# Altium schematic sheet POWER.SchDoc
size A3
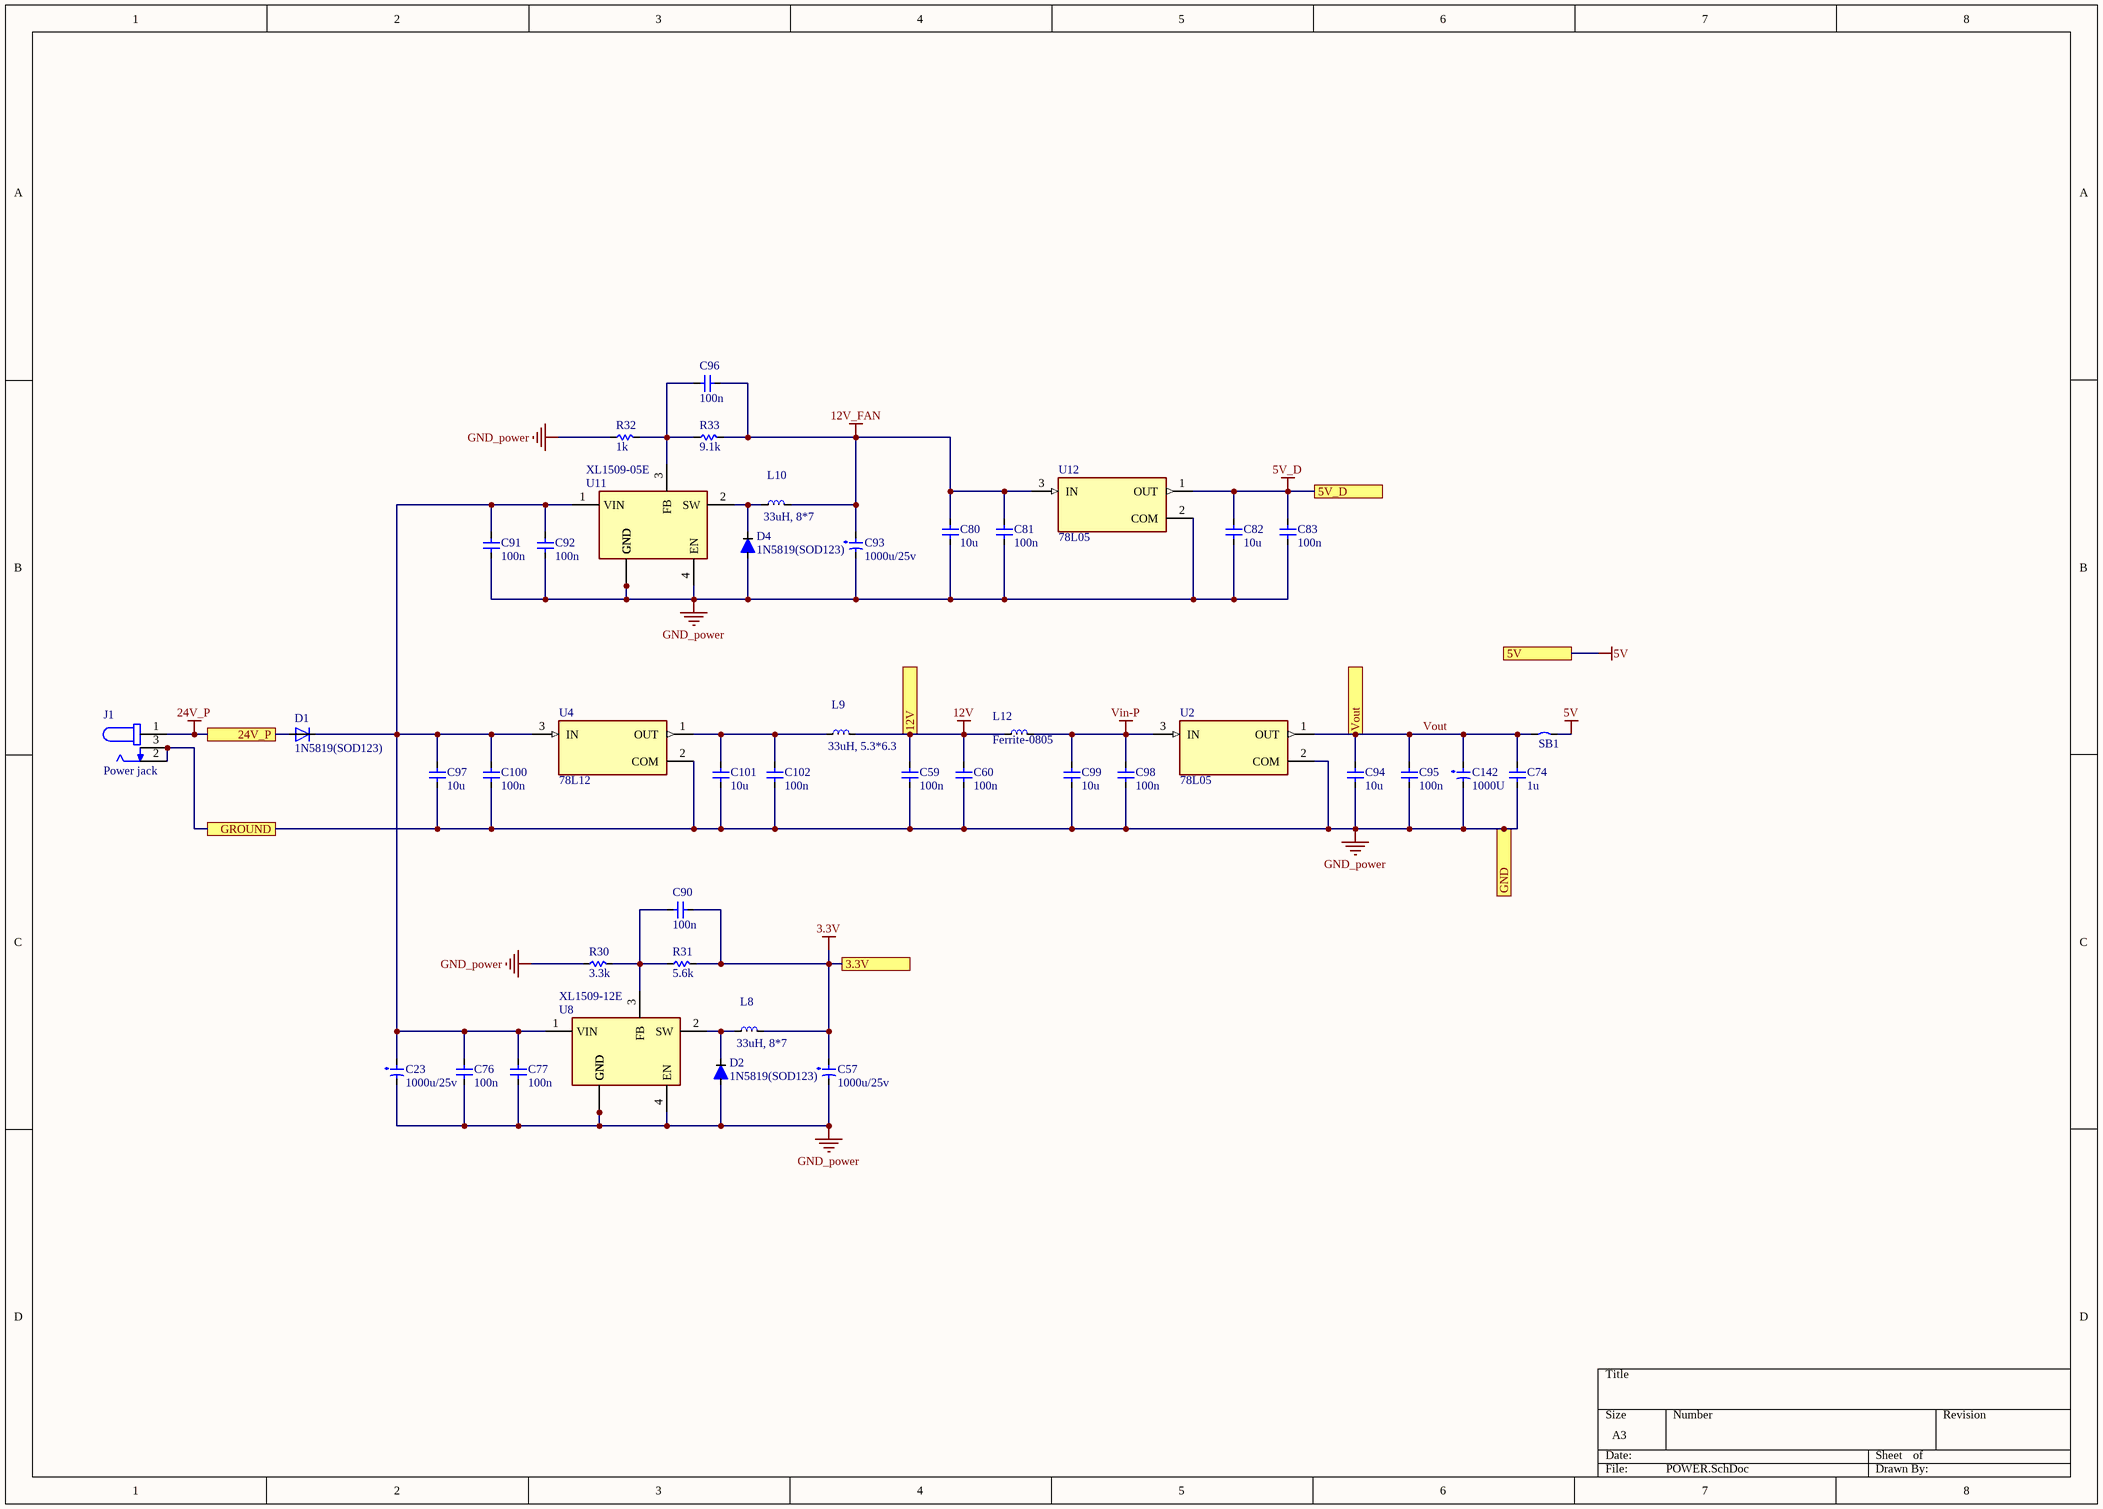
[diagram p0: POWER.SchDoc]

## Parts
C23  1000u/25v  [CAP DIP 10*13]
C57  1000u/25v  [CAP DIP 10*13]
C59  100n  [cap0603]
C60  100n  [cap0603]
C74  1u  [cap0603]
C76  100n  [cap0603]
C77  100n  [cap0603]
C80  10u  [CAP 0805]
C81  100n  [cap0603]
C82  10u  [CAP 0805]
C83  100n  [cap0603]
C90  100n  [cap0603]
C91  100n  [cap0603]
C92  100n  [cap0603]
C93  1000u/25v  [CAP DIP 10*13]
C94  10u  [CAP 0805]
C95  100n  [cap0603]
C96  100n  [cap0603]
C97  10u  [CAP 0805]
C98  100n  [cap0603]
C99  10u  [CAP 0805]
C100  100n  [cap0603]
C101  10u  [CAP 0805]
C102  100n  [cap0603]
C142  1000U  [cap  dip 10*20]
D1  1N5819(SOD123)  [1N5819 SOD-123]
D2  1N5819(SOD123)  [1N5819 SOD-123]
D4  1N5819(SOD123)  [1N5819 SOD-123]
J1  Power jack  [Power jack]
L8  33uH, 8*7  [Inductor 8*7]
L9  33uH, 5.3*6.3  [Inductor SMD 5.3x6.3mm]
L10  33uH, 8*7  [Inductor 8*7]
L12  Ferrite-0805  [Ferrite-0805]
R30  3.3k  [RES-0603]
R31  5.6k  [RES-0603]
R32  1k  [RES-0603]
R33  9.1k  [RES-0603]
SB1  jumper  [JP2_SMD]  (value not drawn)
U2  78L05  [78L05]
U4  78L12  [78L05]
U8  XL1509-12E  [FR9886]
U11  XL1509-05E  [FR9886]
U12  78L05  [78L05]

## Ports
3.3V, 5V, 5V_D, 12V, 24V_P, GND, GROUND, Vout

## Nets
3.3V: C57.1(POS) C90.1 L8.1 R31.2 ; port 3.3V
5V: SB1.2 ; port 5V
5V_D: C82.2 C83.2 U12.1(OUT) ; port 5V_D
12V: C59.2 C60.2 L9.1 L12.2 ; port 12V
12V_FAN: C80.2 C81.2 C93.1(POS) C96.1 L10.1 R33.2 U12.3(IN)
24V_P: D1.2(A) J1.1 ; port 24V_P
GND_power: C23.2(NEG) C57.2(NEG) C59.1 C60.1 C74.1 C76.1 C77.1 C80.1 C81.1 C82.1 C83.1 C91.1 C92.1 C93.2(NEG) C94.1 C95.1 C97.1 C98.1 C99.1 C100.1 C101.1 C102.1 C142.2(NEG) D2.2(C) D4.2(C) J1.2 J1.3 R30.1 R32.1 U2.2(COM) U4.2(COM) U8.4(EN) U8.5(GND) U8.6(GND) U8.7(GND) U8.8(GND) U11.4(EN) U11.5(GND) U11.6(GND) U11.7(GND) U11.8(GND) U12.2(COM) ; port GND, port GROUND
Vin-P: C98.2 C99.2 L12.1 U2.3(IN)
Vout: C74.2 C94.2 C95.2 C142.1(POS) SB1.1 U2.1(OUT) ; port Vout
NetC23_1: C23.1(POS) C76.2 C77.2 C91.2 C92.2 C97.2 C100.2 D1.1(K) U4.3(IN) U8.1(VIN) U11.1(VIN)
NetC90_2: C90.2 R30.2 R31.1 U8.3(FB)
NetC96_2: C96.2 R32.2 R33.1 U11.3(FB)
NetC101_2: C101.2 C102.2 L9.2 U4.1(OUT)
NetD2_1: D2.1(A) L8.2 U8.2(SW)
NetD4_1: D4.1(A) L10.2 U11.2(SW)

## Library data of the parts
C23 C57 C93 = capacitor dip 10*13: 2200ÂµF 50V Aluminum Electrolytic Capacitors Radial, Can 1000 Hrs @ 105Â°C; MF: Nichicon; MP: UVZ1H222MHD; Package: Radial Nichicon; Value: *; Price: None; SnapEDA_Link: https://www.snapeda.com/parts/UVZ1H222MHD/Nichicon/view-part/468437/?ref=snap; Availability: Unavailable
C59 C60 C74 C76 C77 C81 C83 C90-C92 C95 C96 C98 C100 C102 = Cap 0603: Capacitor 0603; Value: 104; Published: 8-Jun-2000; LatestRevisionDate: 17-Jul-2002; LatestRevisionNote: Re-released for DXP Platform.; Publisher: Altium Limited
C80 C82 C94 C97 C99 C101 = Cap 0805: Capacitor 0805; Value: 104; Published: 8-Jun-2000; LatestRevisionDate: 17-Jul-2002; LatestRevisionNote: Re-released for DXP Platform.; Publisher: Altium Limited
C142 = capacitor dip 10*20: 2200ÂµF 50V Aluminum Electrolytic Capacitors Radial, Can 1000 Hrs @ 105Â°C; MF: Nichicon; MP: UVZ1H222MHD; Package: Radial Nichicon; Value: *; Price: None; SnapEDA_Link: https://www.snapeda.com/parts/UVZ1H222MHD/Nichicon/view-part/468437/?ref=snap; Availability: Unavailable
D1 D2 D4 = 1N5819(SOD123): Shotkey diod SOD-123; MP: BAS716; MF: Nexperia USA; SnapEDA_Link: https://www.snapeda.com/parts/BAS716/Nexperia%20USA%20Inc./view-part/143287/?ref=snap; Price: None; Package: SOD-523 NXP Semiconductors; Arrow_Electronics-Purchase-URL: https://snapeda.com/shop?store=Arrow+Electronics&id=143287; Value: *; Availability: Unavailable
J1 = Power jack: 2.0 x 6.5 mm, 2.5 A, Horizontal, Through Hole, Tapered Pins, Dc Power Jack Connector; MF: CUI Devices; MP: PJ-102A; CUI_purchase_URL: https://www.cuidevices.com/product/interconnect/connectors/dc-power-connectors/jacks/pj-102a?utm_source=snapeda.com&utm_medium=referral&utm_campaign=snapedaBOM; Price: None; SnapEDA_Link: https://www.snapeda.com/parts/PJ-102A/CUI%20Devices/view-part/55545/?ref=snap; Value: *; Availability: Unavailable; Package: None
L8 L10 = INDUCTOR 8*7: Inductor round 8*7; MP: DR127-330-R; MF: Eaton; Price: None; Package: Nonstandard Eaton; Availability: Unavailable; SnapEDA_Link: https://www.snapeda.com/parts/DR127-330-R/Eaton/view-part/?ref=snap; Value: *
L9 = INDUCTOR 5.3*6.3: Inductor round 5.3*6.3; MP: DR127-330-R; MF: Eaton; Price: None; Package: Nonstandard Eaton; Availability: Unavailable; SnapEDA_Link: https://www.snapeda.com/parts/DR127-330-R/Eaton/view-part/?ref=snap; Value: *
L12 = Ferrite _0805: BLM Series 0805 330 Ohm 400 mA 0.58 Ohm DCR Surface Mount Ferrite Bead; MF: Murata; MP: BLM18BB331SN1D; Package: 0603 Murata; Price: None; Availability: Unavailable; SnapEDA_Link: https://www.snapeda.com/parts/BLM18BB331SN1D/Murata%20Electronics%20North%20America/view-part/?ref=snap; Value: *
R30-R33 = Res 0603: Resistor 0603; Published: 8-Jun-2000; LatestRevisionDate: 29-May-2009; LatestRevisionNote: IPC-7351 Footprint Added.; PackageReference: J1-0603; Publisher: Altium Limited; PackageDescription: Chip Resistor
SB1 = jumper: Circuit Breaker; Solder: NO; Revision: July-2002: Re-released for DXP Platform.
U2 U4 U12 = 78L05: Linear Voltage Regulator IC 1 Output 100mA SOT-89-3; MP: UA78L05CPK; MF: Texas Instruments; Availability: Unavailable; Package: SOT-89-3 Texas Instruments; SnapEDA_Link: https://www.snapeda.com/parts/UA78L05CPK/Texas%20Instruments/view-part/512891/?ref=snap; Value: *; Price: None
U8 U11 = XL1509-12E: Regulator SOP-8; Manufacturer_Name: Fitipower; Manufacturer_Part_Number: FR9886SOGTR; Datasheet Link: https://www.insidegadgets.com/wp-content/uploads/2015/03/FR9886.pdf; Height: 1.75mm